# Altium schematic sheet Sheet1.SchDoc
size A4
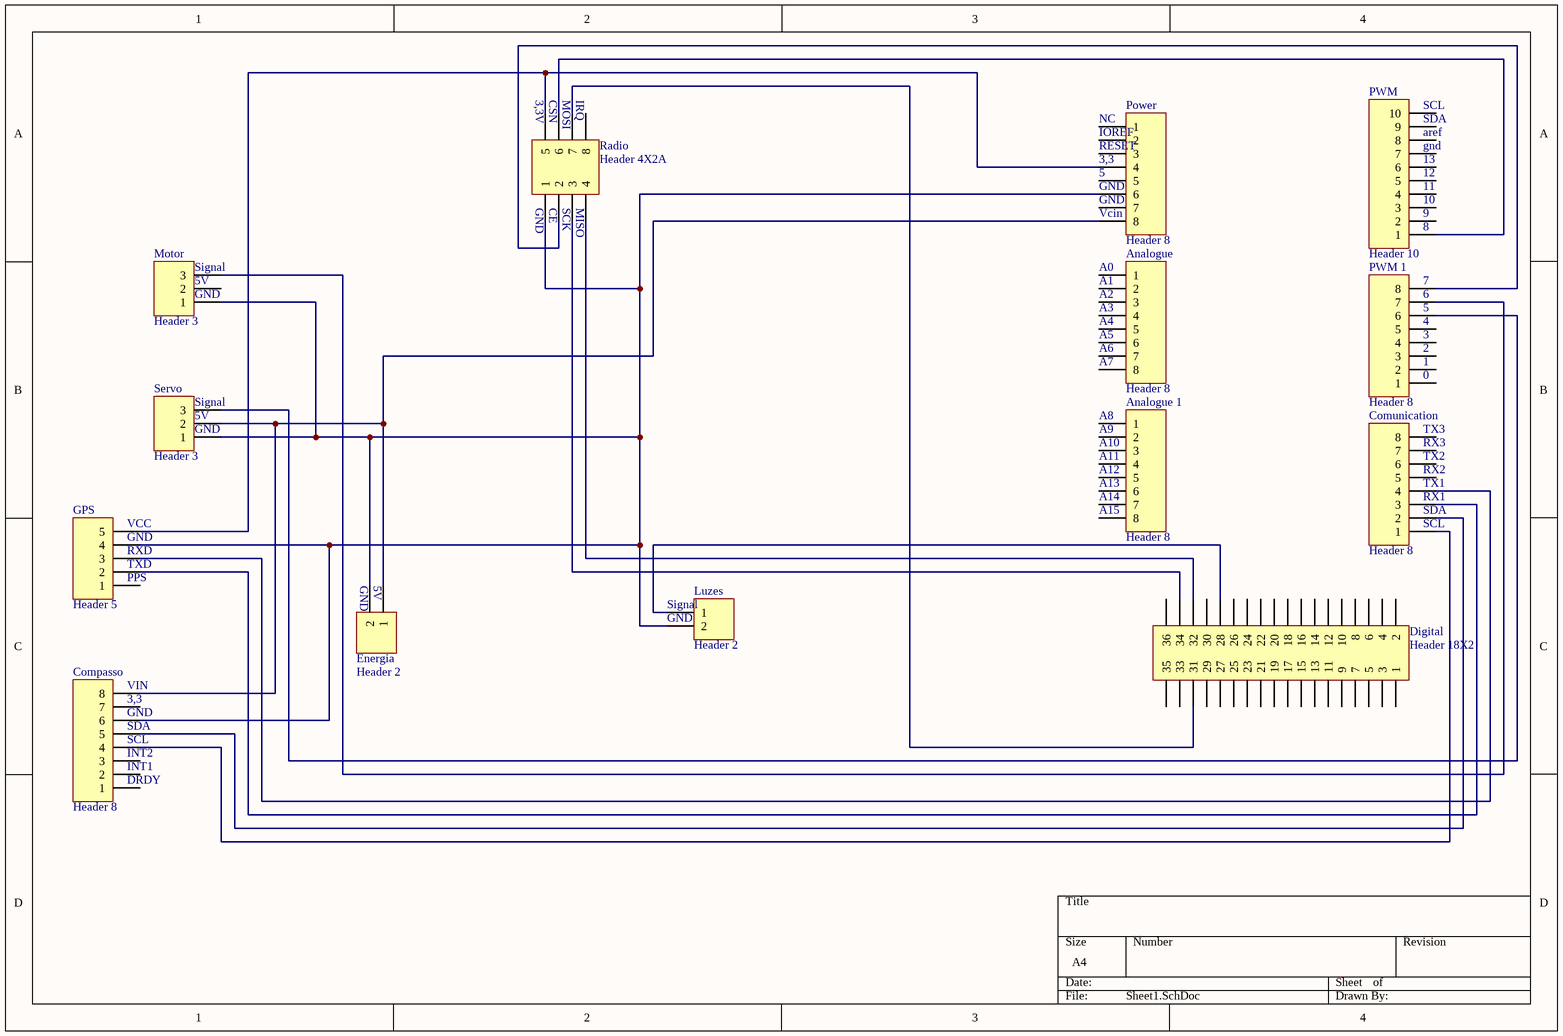
[diagram p0: Sheet1.SchDoc]

## Parts
Analogue  Header 8  [HDR1X8]
Analogue_1  Header 8  [HDR1X8]
Compasso  Header 8  [HDR1X8]
Comunication  Header 8  [HDR1X8]
Digital  Header 18X2  [HDR2X18]
Energia  Header 2  [HDR1X2]
GPS  Header 5  [HDR1X5]
Luzes  Header 2  [HDR1X2]
Motor  Header 3  [HDR1X3]
Power  Header 8  [HDR1X8]
PWM  Header 10  [HDR1X10]
PWM_1  Header 8  [HDR1X8]
Radio  Header 4X2A  [HDR2X4_CEN]
Servo  Header 3  [HDR1X3]

## Nets
NetCompasso_4: Compasso.4 Comunication.1
NetCompasso_5: Compasso.5 Comunication.2
NetCompasso_6: Compasso.6 Energia.2 GPS.4 Luzes.2 Motor.1 Power.6 Radio.1 Servo.1
NetCompasso_8: Compasso.8 Energia.1 Power.8 Servo.2
NetComunication_3: Comunication.3 GPS.2
NetComunication_4: Comunication.4 GPS.3
NetDigital_28: Digital.28 Luzes.1
NetDigital_31: Digital.31 Radio.7
NetDigital_32: Digital.32 Radio.4
NetDigital_34: Digital.34 Radio.3
NetGPS_5: GPS.5 Power.4 Radio.5
NetMotor_3: Motor.3 PWM_1.7
NetPWM_1: PWM.1 Radio.6
NetPWM_1_6: PWM_1.6 Servo.3
NetPWM_1_8: PWM_1.8 Radio.2

Not connected (* = marked no-connect by the designer): Analogue 1 2 3 4 5 6 7 8; Analogue_1 1 2 3 4 5 6 7 8; Compasso 1 2 3 7; Comunication 5 6 7 8; Digital 1 2 3 4 5 6 7 8 9 10 11 12 13 14 15 16 17 18 19 20 21 22 23 24 25 26 27 29 30 33 35 36; GPS 1; Motor 2; Power 1 2 3 5 7; PWM 2 3 4 5 6 7 8 9 10; PWM_1 1 2 3 4 5; Radio 8

## Notes on the sheet
- (near Radio) 3,3V
- (near Radio) CSN
- (near Radio) MOSI
- (near Radio) IRQ
- (near PWM) SCL
- (near Power) NC
- (near Power) IOREF
- (near Power) RESET
- (near Power) 3,3
- (near Power) 5
- (near PWM) 12
- (near PWM) 13
- (near PWM) gnd
- (near PWM) aref
- (near PWM) SDA
- (near Radio) GND
- (near Radio) CE
- (near Radio) SCK
- (near Radio) MISO
- (near Power) GND
- (near Power) Vcin
- (near PWM) 8
- (near PWM) 9
- (near PWM) 10
- (near PWM) 11
- (near Motor) GND
- (near Motor) 5V
- (near Motor) Signal
- (near Analogue) A0
- (near Analogue) A1
- (near Analogue) A2
- (near Analogue) A3
- (near PWM_1) 5
- (near PWM_1) 6
- (near PWM_1) 7
- (near Analogue) A4
- (near Analogue) A5
- (near Analogue) A6
- (near Analogue) A7
- (near PWM_1) 0
- (near PWM_1) 1
- (near PWM_1) 2
- (near PWM_1) 3
- (near PWM_1) 4
- (near Servo) GND
- (near Servo) 5V
- (near Servo) Signal
- (near Analogue_1) A8
- (near Analogue_1) A9
- (near Analogue_1) A10
- (near Comunication) TX3
- (near Comunication) RX3
- (near Analogue_1) A11
- (near Analogue_1) A12
- (near Analogue_1) A13
- (near Analogue_1) A14
- (near Analogue_1) A15
- (near Comunication) TX2
- (near Comunication) RX2
- (near Comunication) TX1
- (near Comunication) RX1
- (near Comunication) SDA
- (near GPS) VCC
- (near GPS) GND
- (near GPS) RXD
- (near GPS) TXD
- (near GPS) PPS
- (near Energia) GND
- (near Energia) 5V
- (near Comunication) SCL
- (near Luzes) GND
- (near Luzes) Signal
- (near Compasso) VIN
- (near Compasso) 3,3
- (near Compasso) GND
- (near Compasso) SDA
- (near Compasso) SCL
- (near Compasso) INT2
- (near Compasso) INT1
- (near Compasso) DRDY

## Library data of the parts
Analogue Analogue_1 Compasso Comunication Power PWM_1 = Header 8: Header, 8-Pin; LatestRevisionDate: 17-Jul-2002; LatestRevisionNote: Re-released for DXP Platform.; Publisher: Altium Limited
Digital = Header 18X2: Header, 18-Pin, Dual row; LatestRevisionDate: 17-Jul-2002; LatestRevisionNote: Re-released for DXP Platform.; Publisher: Altium Limited
Energia Luzes = Header 2: Header, 2-Pin; LatestRevisionDate: 17-Jul-2002; LatestRevisionNote: Re-released for DXP Platform.; Publisher: Altium Limited
GPS = Header 5: Header, 5-Pin; LatestRevisionDate: 17-Jul-2002; LatestRevisionNote: Re-released for DXP Platform.; Publisher: Altium Limited
Motor Servo = Header 3: Header, 3-Pin; LatestRevisionDate: 17-Jul-2002; LatestRevisionNote: Re-released for DXP Platform.; Publisher: Altium Limited
PWM = Header 10: Header, 10-Pin; LatestRevisionDate: 17-Jul-2002; LatestRevisionNote: Re-released for DXP Platform.; Publisher: Altium Limited
Radio = Header 4X2A: Header, 4-Pin, Dual row; LatestRevisionDate: 17-Jul-2002; LatestRevisionNote: Re-released for DXP Platform.; Publisher: Altium Limited